# EAGLE design addon (EAGLE 6.6.0)
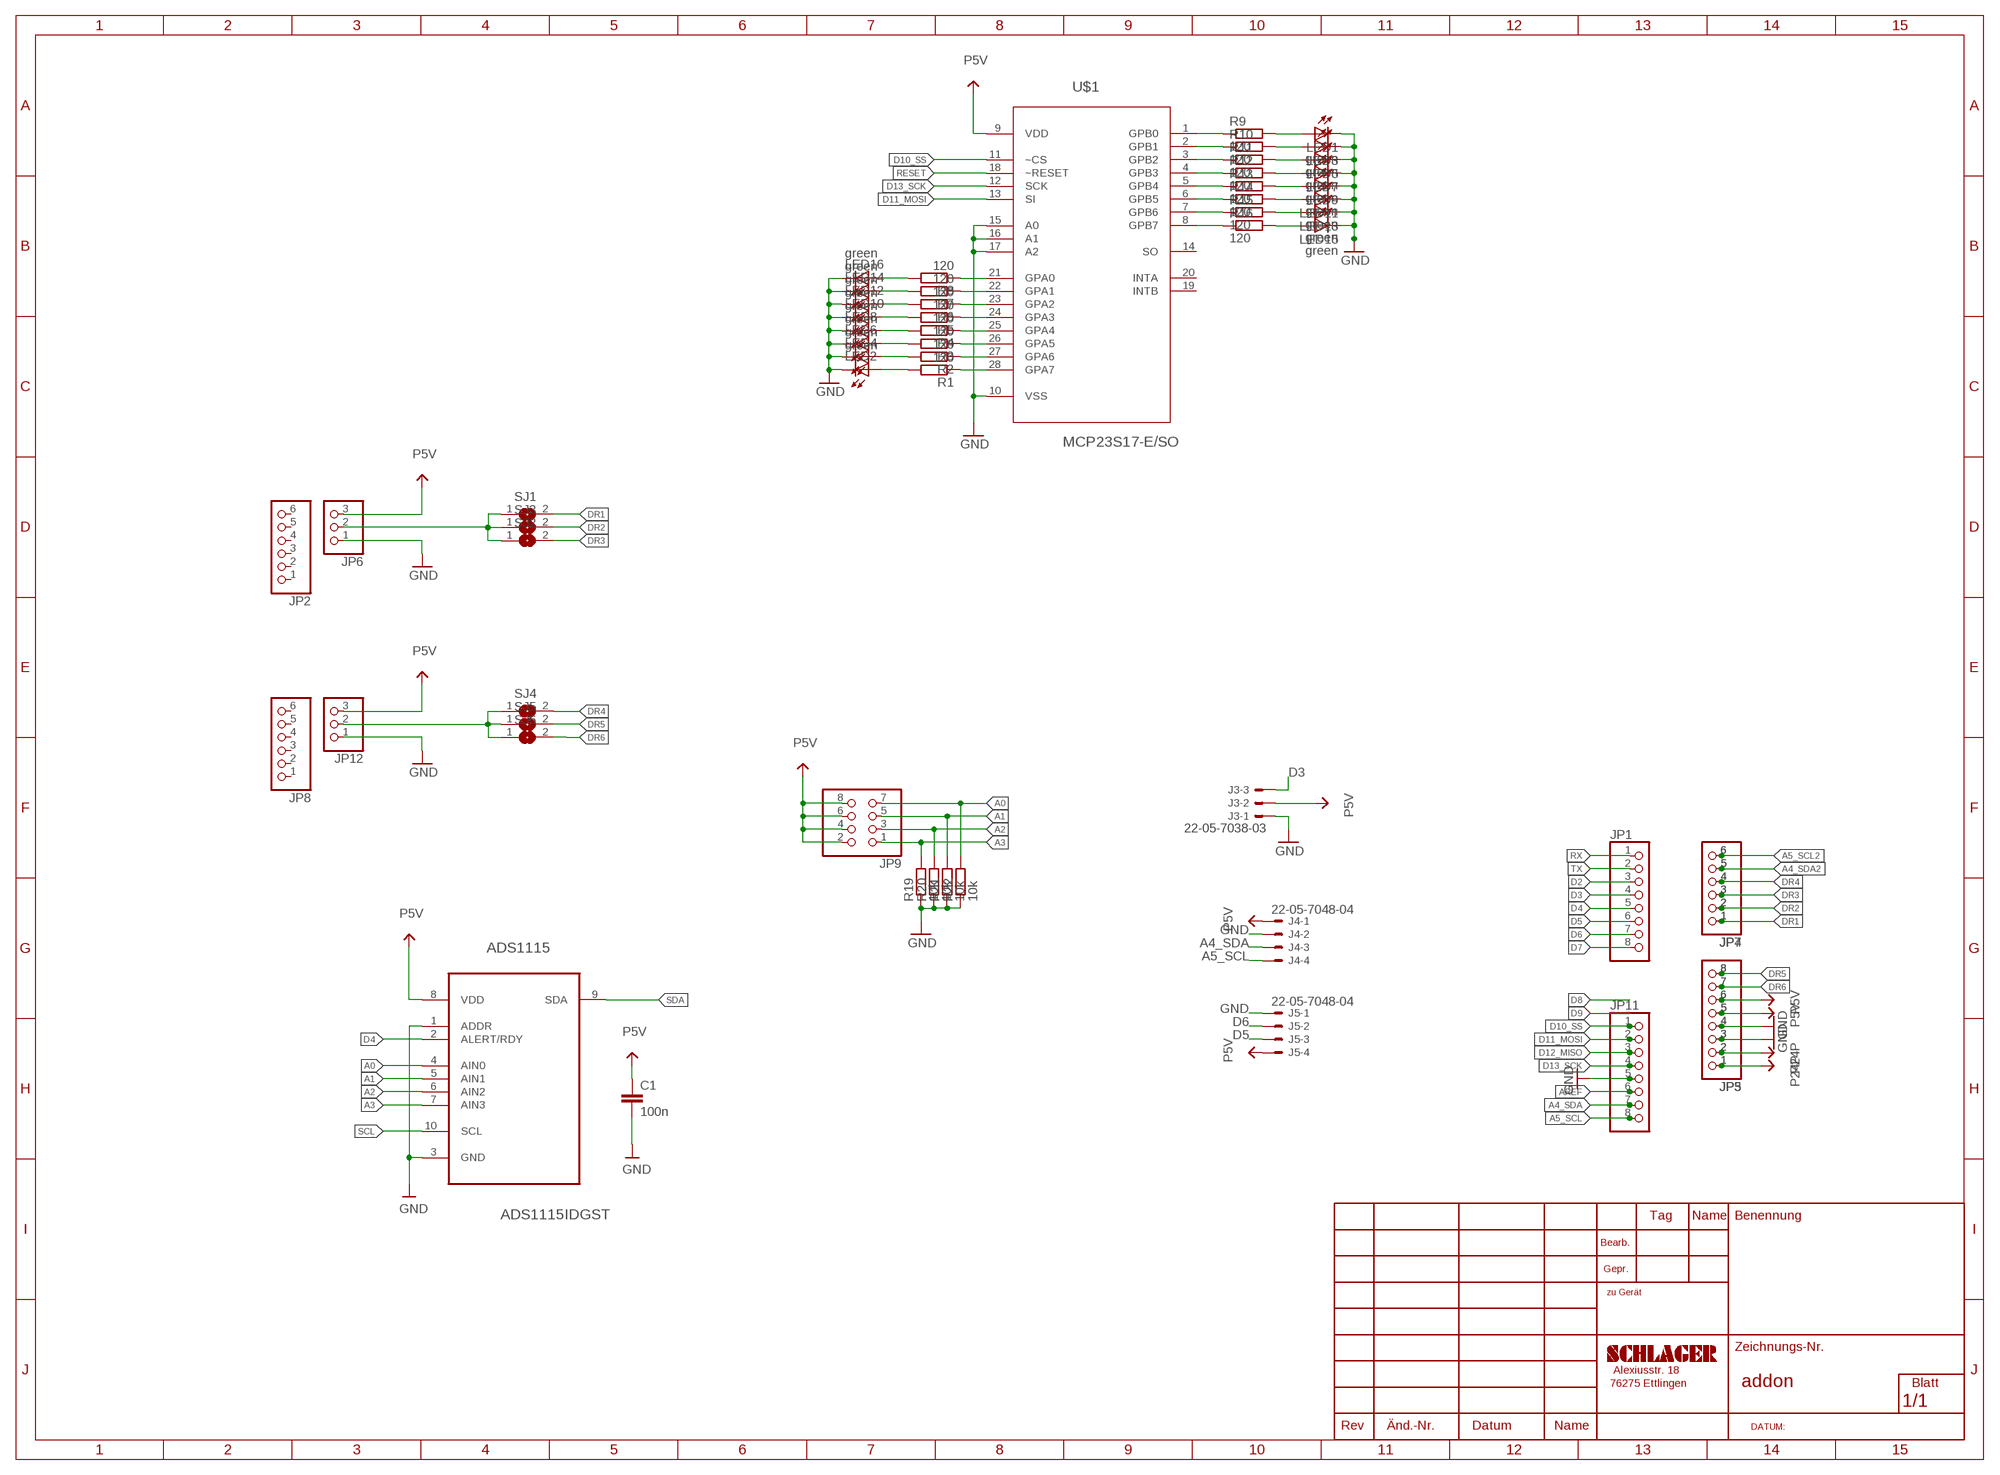
[diagram p0: schematic, sheet 1]

## Parts
ADS1115  ADS1115IDGST  [SOP50P490X110-10N]
C1  100n  C-EUC0805  [C0805]
J3  22-05-7038-03  [7395-03]
J4  22-05-7048-04  [7395-04]
J5  22-05-7048-04  [7395-04]
JP1  PINHD-1X8  [1X08]
JP2  PINHD-1X6  [1X06]
JP3  PINHD-1X8  [1X08]
JP4  PINHD-1X6  [1X06]
JP5  PINHD-1X8  [1X08]
JP6  PINHD-1X3  [1X03]
JP7  PINHD-1X6  [1X06]
JP8  PINHD-1X6  [1X06]
JP9  PINHD-2X4/90  [2X04/90]
JP11  PINHD-1X8  [1X08]
JP12  PINHD-1X3  [1X03]
LED1  green  LEDCHIPLED_0805  [CHIPLED_0805]
LED2  green  LEDCHIPLED_0805  [CHIPLED_0805]
LED3  green  LEDCHIPLED_0805  [CHIPLED_0805]
LED4  green  LEDCHIPLED_0805  [CHIPLED_0805]
LED5  green  LEDCHIPLED_0805  [CHIPLED_0805]
LED6  green  LEDCHIPLED_0805  [CHIPLED_0805]
LED7  green  LEDCHIPLED_0805  [CHIPLED_0805]
LED8  green  LEDCHIPLED_0805  [CHIPLED_0805]
LED9  green  LEDCHIPLED_0805  [CHIPLED_0805]
LED10  green  LEDCHIPLED_0805  [CHIPLED_0805]
LED11  green  LEDCHIPLED_0805  [CHIPLED_0805]
LED12  green  LEDCHIPLED_0805  [CHIPLED_0805]
LED13  green  LEDCHIPLED_0805  [CHIPLED_0805]
LED14  green  LEDCHIPLED_0805  [CHIPLED_0805]
LED15  green  LEDCHIPLED_0805  [CHIPLED_0805]
LED16  green  LEDCHIPLED_0805  [CHIPLED_0805]
R1  120  R-EU_R0805  [R0805]
R2  120  R-EU_R0805  [R0805]
R3  120  R-EU_R0805  [R0805]
R4  120  R-EU_R0805  [R0805]
R5  120  R-EU_R0805  [R0805]
R6  120  R-EU_R0805  [R0805]
R7  120  R-EU_R0805  [R0805]
R8  120  R-EU_R0805  [R0805]
R9  120  R-EU_R0805  [R0805]
R10  120  R-EU_R0805  [R0805]
R11  120  R-EU_R0805  [R0805]
R12  120  R-EU_R0805  [R0805]
R13  120  R-EU_R0805  [R0805]
R14  120  R-EU_R0805  [R0805]
R15  120  R-EU_R0805  [R0805]
R16  120  R-EU_R0805  [R0805]
R19  10k  R-EU_R0805  [R0805]
R20  10k  R-EU_R0805  [R0805]
R21  10k  R-EU_R0805  [R0805]
R22  10k  R-EU_R0805  [R0805]
SJ1  SJ  [SJ]
SJ2  SJ  [SJ]
SJ3  SJ  [SJ]
SJ4  SJ  [SJ]
SJ5  SJ  [SJ]
SJ6  SJ  [SJ]
U$1  MCP23S17-E/SO  [SOIC127P030X265-28N]

## Nets
A0: ADS1115.4(AIN0) JP9.7 R22.2
A1: ADS1115.5(AIN1) JP9.5 R21.2
A2: ADS1115.6(AIN2) JP9.3 R20.2
A3: ADS1115.7(AIN3) JP9.1 R19.2
A4_SDA: J4.3 JP11.7
A4_SDA2: JP4.5 JP7.5
A5_SCL: J4.4 JP11.8
A5_SCL2: JP4.6 JP7.6
AREF: JP11.6
D2: JP1.3
D3: J3.3 JP1.4
D4: ADS1115.2(ALERT/RDY) JP1.5
D5: J5.3 JP1.6
D6: J5.2 JP1.7
D7: JP1.8
D10_SS: JP11.1 U$1.11(~CS)
D11_MOSI: JP11.2 U$1.13(SI)
D12_MISO: JP11.3
D13_SCK: JP11.4 U$1.12(SCK)
DR1: JP4.1 JP7.1 SJ1.2
DR2: JP4.2 JP7.2 SJ3.2
DR3: JP4.3 JP7.3 SJ2.2
DR4: JP4.4 JP7.4 SJ4.2
DR5: JP3.8 JP5.8 SJ5.2
DR6: JP3.7 JP5.7 SJ6.2
GND: ADS1115.1(ADDR) ADS1115.3(GND) C1.2 J3.1 J4.2 J5.1 JP3.3 JP3.4 JP5.3 JP5.4 JP6.1 JP11.5 JP12.1 LED1.C LED2.C LED3.C LED4.C LED5.C LED6.C LED7.C LED8.C LED9.C LED10.C LED11.C LED12.C LED13.C LED14.C LED15.C LED16.C R19.1 R20.1 R21.1 R22.1 U$1.10(VSS) U$1.15(A0) U$1.16(A1) U$1.17(A2)
N$1: LED1.A R9.2
N$2: LED3.A R10.2
N$3: LED5.A R11.2
N$4: LED7.A R12.2
N$5: LED9.A R13.2
N$6: LED11.A R14.2
N$7: LED13.A R15.2
N$8: LED15.A R16.2
N$9: R9.1 U$1.1(GPB0)
N$10: R10.1 U$1.2(GPB1)
N$11: R11.1 U$1.3(GPB2)
N$12: R12.1 U$1.4(GPB3)
N$13: R13.1 U$1.5(GPB4)
N$14: R14.1 U$1.6(GPB5)
N$15: R15.1 U$1.7(GPB6)
N$16: R16.1 U$1.8(GPB7)
N$17: LED2.A R1.2
N$18: LED4.A R2.2
N$19: LED6.A R3.2
N$20: LED8.A R4.2
N$21: LED10.A R5.2
N$22: LED12.A R6.2
N$23: LED14.A R7.2
N$24: LED16.A R8.2
N$25: R1.1 U$1.28(GPA7)
N$26: R2.1 U$1.27(GPA6)
N$27: R3.1 U$1.26(GPA5)
N$28: R4.1 U$1.25(GPA4)
N$29: R5.1 U$1.24(GPA3)
N$30: R6.1 U$1.23(GPA2)
N$31: R7.1 U$1.22(GPA1)
N$32: R8.1 U$1.21(GPA0)
N$33: JP6.2 SJ1.1 SJ2.1 SJ3.1
N$34: JP12.2 SJ4.1 SJ5.1 SJ6.1
P5V: ADS1115.8(VDD) C1.1 J3.2 J4.1 J5.4 JP3.5 JP3.6 JP5.5 JP5.6 JP6.3 JP9.2 JP9.4 JP9.6 JP9.8 JP12.3 U$1.9(VDD)
P24P: JP3.1 JP3.2 JP5.1 JP5.2
RESET: U$1.18(~RESET)
RX: JP1.1
SCL: ADS1115.10(SCL)
SDA: ADS1115.9(SDA)
TX: JP1.2
Unconnected: JP2.1 JP2.2 JP2.3 JP2.4 JP2.5 JP2.6 JP8.1 JP8.2 JP8.3 JP8.4 JP8.5 JP8.6 U$1.14(SO) U$1.19(INTB) U$1.20(INTA)

## Library data of the parts
ADS1115 = schlager_ics:ADS1115IDGST: Analog-to-Digital Converter with Internal Reference; MPN: ADS1115IDGST; OC_FARNELL: 1762981; OC_NEWARK: 25R1241; PACKAGE: MSOP-10; SUPPLIER: Texas Instruments
C1 = schlager_passiv:C-EU: CAPACITOR, European symbol
J3 = con-molex:22-?-03: CONNECTOR wire to board 2.54 mm (.1 inch) pitch header; OC_FARNELL: unknown; OC_NEWARK: unknown
J4 J5 = con-molex:22-?-04: CONNECTOR wire to board 2.54 mm (.1 inch) pitch header; OC_FARNELL: unknown; OC_NEWARK: unknown
JP1 JP3 JP5 JP11 = pinhead:PINHD-1X8: PIN HEADER
JP2 JP4 JP7 JP8 = pinhead:PINHD-1X6: PIN HEADER
JP6 JP12 = pinhead:PINHD-1X3: PIN HEADER
JP9 = pinhead:PINHD-2X4: PIN HEADER
LED1-LED16 = led:LED: LED OSRAM: - CHIPLED LG R971, LG N971, LY N971, LG Q971, LY Q971, LO R971, LY R971 LH N974, LH R974 LS Q976, LO Q976, LY Q976 LO Q996 - Hyper CHIPLED LW Q18S LB Q993, LB Q99A, LB R99A - SideLED LS A670, LO A670, LY A670, LG A670, LP A670 LB A673, LV A673, LT A673, LW A673 LH A674 LY A675 LS A676, LA A676, LO A676, LY A676, LW A676 LS A679, LY A679, LG A679 - Hyper Micro SIDELED® LS Y876, LA Y876, LO Y876, LY Y876 LT Y87S - SmartLED LW L88C, LW L88S LB L89C, LB L89S, LG L890 LS L89K, LO L89K, LY L89K LS L896, LA L896, LO L896, LY L896 - TOPLED LS T670, LO T670, LY T670, LG T670, LP T670 LSG T670, LSP T670, LSY T670, LOP T670, LYG T670 LG T671, LOG T671, LSG T671 LB T673, LV T673, LT T673, LW T673 LH T674 LS T676, LA T676, LO T676, LY T676, LB T676, LH T676, LSB T676, LW T676 LB T67C, LV T67C, LT T67C, LS T67K, LO T67K, LY T67K, LW E67C LS E67B, LA E67B, LO E67B, LY E67B, LB E67C, LV E67C, LT E67C LW T67C LS T679, LY T679, LG T679 LS T770, LO T770, LY T770, LG T770, LP T770 LB T773, LV T773, LT T773, LW T773 LH T774 LS E675, LA E675, LY E675, LS T675 LS T776, LA T776, LO T776, LY T776, LB T776 LHGB T686 LT T68C, LB T68C - Hyper Mini TOPLED® LB M676 - Mini TOPLED Santana® LG M470 LS M47K, LO M47K, LY M47K Source: http://www.osram.convergy.de LUXEON: - LUMILED® LXK2-PW12-R00, LXK2-PW12-S00, LXK2-PW14-U00, LXK2-PW14-V00 LXK2-PM12-R00, LXK2-PM12-S00, LXK2-PM14-U00 LXK2-PE12-Q00, LXK2-PE12-R00, LXK2-PE12-S00, LXK2-PE14-T00, LXK2-PE14-U00 LXK2-PB12-K00, LXK2-PB12-L00, LXK2-PB12-M00, LXK2-PB14-N00, LXK2-PB14-P00, LXK2-PB14-Q00 LXK2-PR12-L00, LXK2-PR12-M00, LXK2-PR14-Q00, LXK2-PR14-R00 LXK2-PD12-Q00, LXK2-PD12-R00, LXK2-PD12-S00 LXK2-PH12-R00, LXK2-PH12-S00 LXK2-PL12-P00, LXK2-PL12-Q00, LXK2-PL12-R00 Source: www.luxeon.com KINGBRIGHT: KA-3528ASYC Source: www.kingbright.com
R1-R16 R19-R22 = rcl:R-EU_: RESISTOR, European symbol
SJ1-SJ6 = jumper:SJ: SMD solder JUMPER
U$1 = schlager_ics:MCP23S17-E/SO: 16-Bit I/O Expander; DESCRIPTION: IC I/O EXPANDER; MPN: MCP23S17-E/SO; OC_FARNELL: 1332093; OC_NEWARK: 31K2950; PACKAGE: SOIC-28; SUPPLIER: Microchip

## Net classes
4 USBpair: width 0.254 mm, drill 0.406 mm, clearance 0.508 mm

## Board
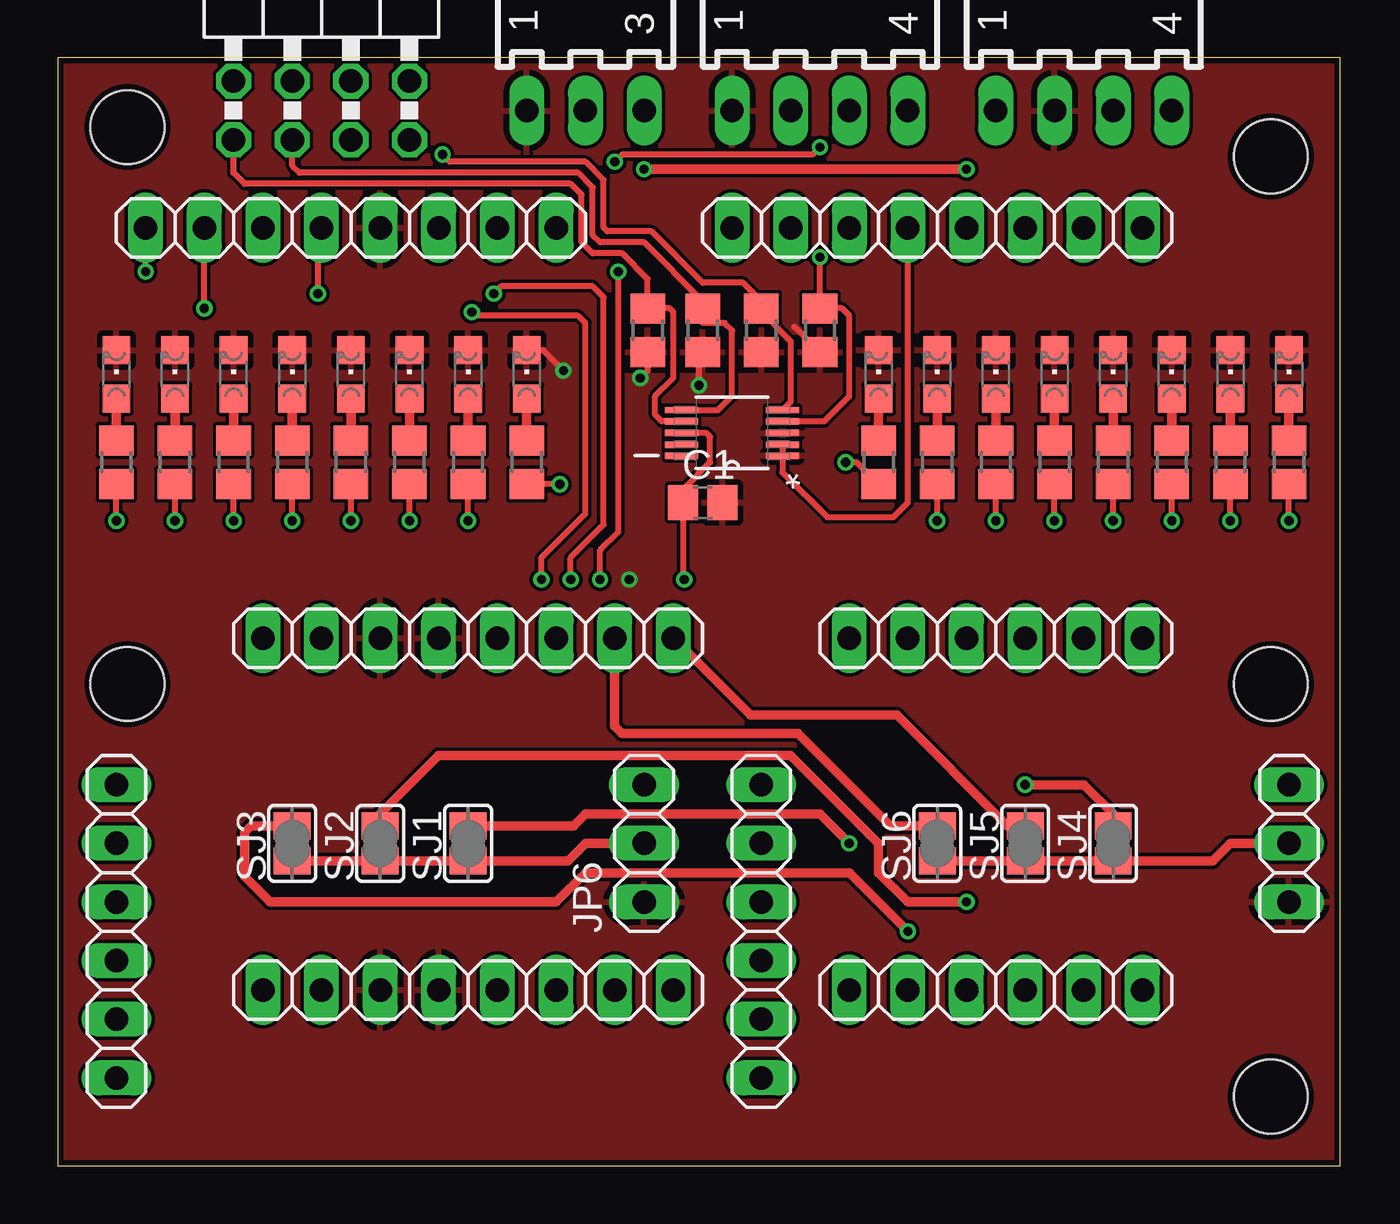
[diagram p1: board, top side]
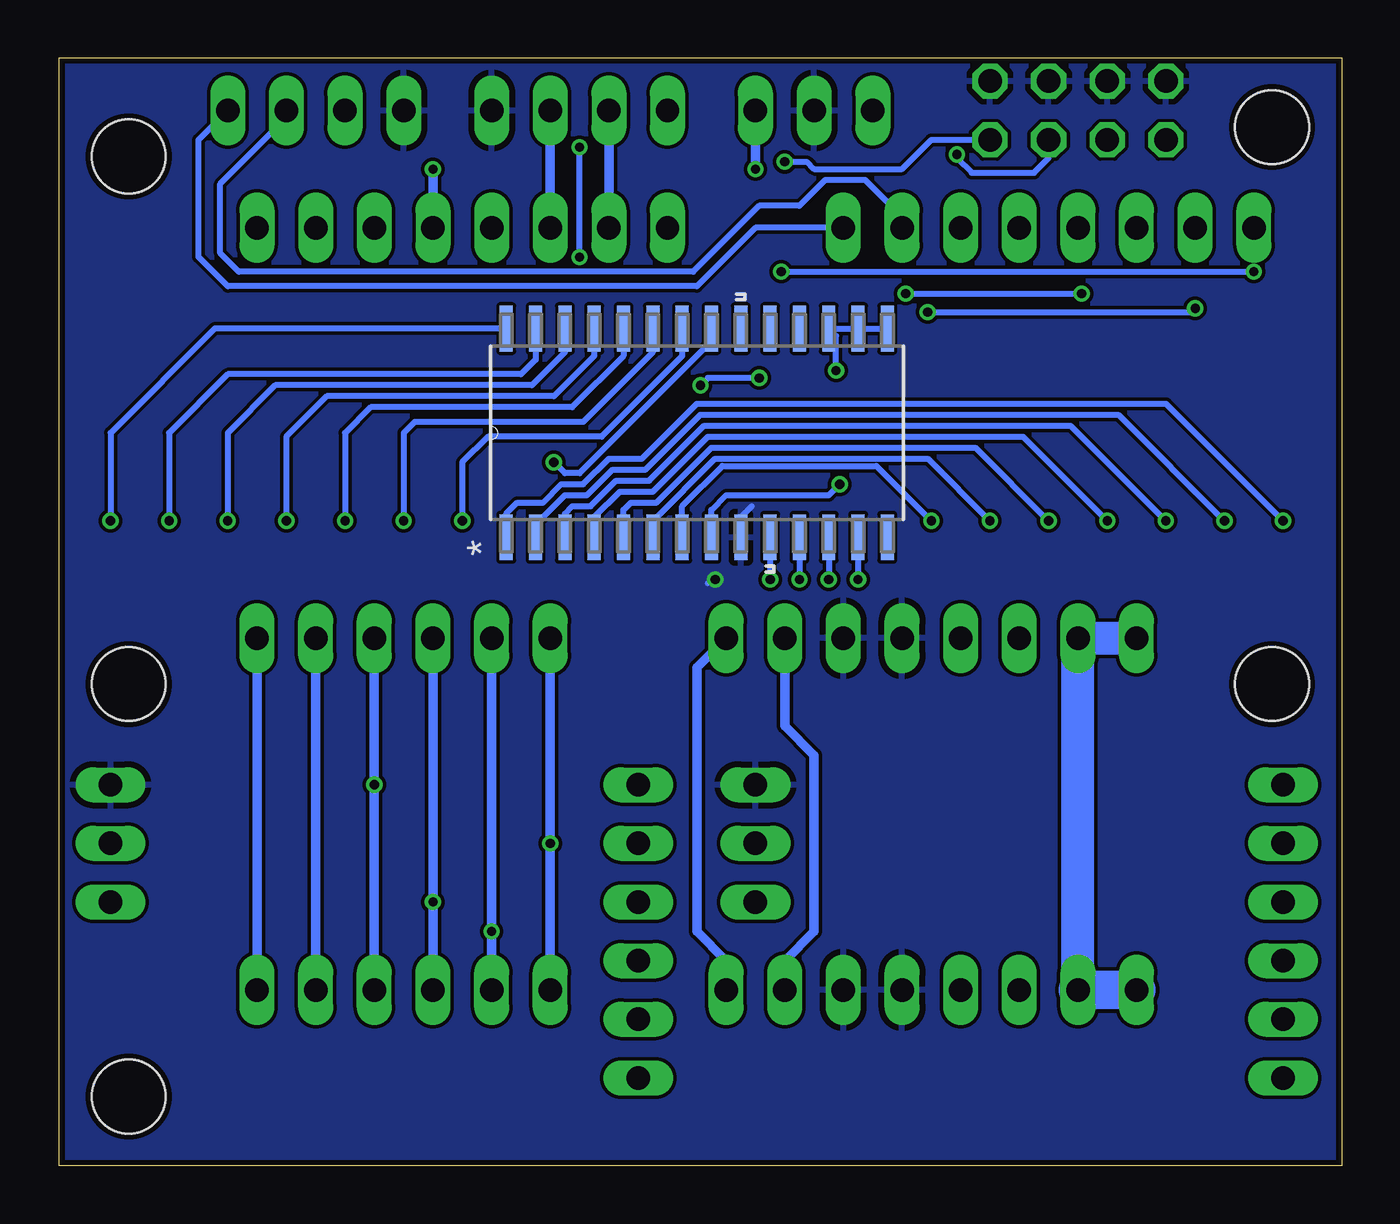
[diagram p2: board, bottom side, seen from below]

Size 55.55 x 48 mm. Coordinates in mm from the lower left corner, seen from the top.
Outline: 0,0 55.55,0 55.55,48 0,48 0,0
Copper layers (1*16): Top 0.035mm / dielectric 1.5mm / Bottom 0.035mm
Design rules "ITEADstudio_DRC": minimum track width 6mil, minimum drill 12mil, track to track 6mil, track to pad 6mil, pad to pad 6mil, via to via 6mil, smd to smd 0mil, copper to edge 10mil, drill to drill 10mil, minimum pad ring 10mil, minimum via ring 6mil, stop-mask expansion 2mil, vias tented up to drill 100mil, thermal gap 10mil
Holes 3.2 mm at 52.55,43.73 52.55,3 3.02,45 3.02,20.87 52.55,20.87

### Footprints (pad centres in the part's own frame; a part is rotated, then mirrored left to right if it is on the bottom)
SOP50P490X110-10N = smd 1.422 x 0.279: 1 -2.184,0.991; 2 -2.184,0.508; 3 -2.184,0; 4 -2.184,-0.508; 5 -2.184,-0.991; 6 2.184,-0.991; 7 2.184,-0.508; 8 2.184,0; 9 2.184,0.508; 10 2.184,0.991
C0805 = smd 1.3 x 1.5: 1 -0.85,0; 2 0.85,0
7395-03 = drill 1.016 long: 1 2.54,0; 2 0,0; 3 -2.54,0
7395-04 = drill 1.016 long: 1 3.81,0; 2 1.27,0; 3 -1.27,0; 4 -3.81,0
1X08 = drill 1.016 long: 1 -8.89,0; 2 -6.35,0; 3 -3.81,0; 4 -1.27,0; 5 1.27,0; 6 3.81,0; 7 6.35,0; 8 8.89,0
1X06 = drill 1.016 long: 1 -6.35,0; 2 -3.81,0; 3 -1.27,0; 4 1.27,0; 5 3.81,0; 6 6.35,0
1X03 = drill 1.016 long: 1 -2.54,0; 2 0,0; 3 2.54,0
2X04/90 = drill 1.016 octagon: 1 -3.81,-6.35; 2 -3.81,-3.81; 3 -1.27,-6.35; 4 -1.27,-3.81; 5 1.27,-6.35; 6 1.27,-3.81; 7 3.81,-6.35; 8 3.81,-3.81
CHIPLED_0805 = smd 1.2 x 1.2: A 0,-1.05; C 0,1.05
R0805 = smd 1.3 x 1.5: 1 -0.95,0; 2 0.95,0
SJ = smd 1.168 x 1.6: 1 -0.762,0; 2 0.762,0
SOIC127P030X265-28N = smd 1.981 x 0.559: 1 -4.521,8.255; 2 -4.521,6.985; 3 -4.521,5.715; 4 -4.521,4.445; 5 -4.521,3.175; 6 -4.521,1.905; 7 -4.521,0.635; 8 -4.521,-0.635; 9 -4.521,-1.905; 10 -4.521,-3.175; 11 -4.521,-4.445; 12 -4.521,-5.715; 13 -4.521,-6.985; 14 -4.521,-8.255; 15 4.521,-8.255; 16 4.521,-6.985; 17 4.521,-5.715; 18 4.521,-4.445; 19 4.521,-3.175; 20 4.521,-1.905; 21 4.521,-0.635; 22 4.521,0.635; 23 4.521,1.905; 24 4.521,3.175; 25 4.521,4.445; 26 4.521,5.715; 27 4.521,6.985; 28 4.521,8.255

### Placement (x,y rotation side)
ADS1115  29.21,31.75 180 top
C1  27.94,28.73 0 top
J3  22.86,45.72 180 top
J4  44.45,45.72 180 top
J5  33.02,45.72 180 top
JP1  38.1,40.64 180 top
JP2  2.54,10.16 90 top
JP3  17.78,22.86 0 top
JP4  40.64,7.62 0 top
JP5  17.78,7.62 0 top
JP6  25.4,13.97 90 top
JP7  40.64,22.86 0 top
JP8  30.48,10.16 90 top
JP9  11.43,50.8 0 top
JP11  12.7,40.64 0 top
JP12  53.34,13.97 90 top
LED1  2.54,34.29 0 top
LED2  53.34,34.29 0 top
LED3  5.08,34.29 0 top
LED4  50.8,34.29 0 top
LED5  7.62,34.29 0 top
LED6  48.26,34.29 0 top
LED7  10.16,34.29 0 top
LED8  45.72,34.29 0 top
LED9  12.7,34.29 0 top
LED10  43.18,34.29 0 top
LED11  15.24,34.29 0 top
LED12  40.64,34.29 0 top
LED13  17.78,34.29 0 top
LED14  38.1,34.29 0 top
LED15  20.32,34.29 0 top
LED16  35.56,34.29 0 top
R1  53.34,30.48 90 top
R2  50.8,30.48 90 top
R3  48.26,30.48 90 top
R4  45.72,30.48 90 top
R5  43.18,30.48 90 top
R6  40.64,30.48 90 top
R7  38.1,30.48 90 top
R8  35.56,30.48 90 top
R9  2.54,30.48 90 top
R10  5.08,30.48 90 top
R11  7.62,30.48 90 top
R12  10.16,30.48 90 top
R13  12.7,30.48 90 top
R14  15.24,30.48 90 top
R15  17.78,30.48 90 top
R16  20.32,30.48 90 top
R19  25.56,36.2 90 top
R20  27.94,36.2 90 top
R21  30.48,36.2 90 top
R22  33.02,36.2 90 top
SJ1  17.78,13.97 90 top
SJ2  13.97,13.97 90 top
SJ3  10.16,13.97 90 top
SJ4  45.72,13.97 90 top
SJ5  41.91,13.97 90 top
SJ6  38.1,13.97 90 top
U$1  27.94,31.75 90 bottom

### Tracks (layer width: path | path; a pad name or v marks a point on that pad's centre or on a via)
A0  (via drill 0.4)
  Top 0.254: ADS1115.4 33.21,32.26 34.29,33.34 34.29,36.83 33.97,37.15 R22.2 v33.02,39.37 | v33.02,44.13 32.7,43.81 24.45,43.81 v24.13,43.5
  Bottom 0.254: v24.13,43.5 23.18,43.5 22.86,43.18 19.05,43.18 17.78,44.45 JP9.7 | v33.02,39.37 v33.02,44.13
A1  (via drill 0.4)
  Top 0.254: ADS1115.5 31.75,33.1 31.75,35.72 31.12,36.35 R21.2 30.48,37.47 29.69,38.26 27.94,38.26 25.72,40.48 23.81,40.48 23.65,40.64 23.65,42.7 22.86,43.5 16.99,43.5 v16.67,43.81
  Bottom 0.254: v16.67,43.81 16.67,43.66 16.03,43.02 13.34,43.02 12.7,43.66 JP9.5
A2
  Top 0.254: ADS1115.6 28.61,32.74 29.21,33.34 29.21,36.2 28.89,36.51 27.94,36.51 R20.2 27.94,37.47 25.4,40.01 23.5,40.01 23.18,40.32 23.18,42.39 22.54,43.02 10.48,43.02 10.16,43.34 JP9.3
A3
  Top 0.254: ADS1115.7 26.16,32.26 25.88,32.54 25.88,33.34 26.67,34.13 26.67,36.99 26.51,37.15 R19.2 25.56,38.42 24.45,39.53 23.18,39.53 22.7,40.01 22.7,42.07 22.23,42.55 8.1,42.55 7.62,43.02 JP9.1
A4_SDA
  Bottom 0.254: JP11.7 19.05,41.12 20.64,42.7 22.38,42.7 23.5,41.59 25.24,41.59 28.1,38.73 47.78,38.73 48.58,39.53 48.58,42.55 46.2,44.93 46.2,45.24 J4.3
A4_SDA2
  Bottom 0.406: JP4.5 JP7.5
A5_SCL
  Bottom 0.254: JP11.8 25.4,40.64 27.94,38.1 48.26,38.1 49.53,39.37 49.53,44.45 J4.4
A5_SCL2
  Bottom 0.406: JP4.6 JP7.6
D3  (via drill 0.4)
  Top 0.406: v25.4,43.18 v39.37,43.18
  Bottom 0.406: J3.3 v25.4,43.18 | v39.37,43.18 JP1.4
D4
  Top 0.254: ADS1115.2 31.39,30.04 33.34,28.1 36.2,28.1 36.83,28.73 JP1.5
D5
  Bottom 0.406: JP1.6 J5.3
D6
  Bottom 0.406: JP1.7 J5.2
D10_SS  (via drill 0.4)
  Top 0.254: v23.5,25.4 23.5,26.67 24.29,27.46 v24.29,38.73 | v3.81,38.73 JP11.1
  Bottom 0.254: U$1.11 v23.5,25.4 | v24.29,38.73 v3.81,38.73
D11_MOSI  (via drill 0.4)
  Top 0.254: v20.95,25.4 20.95,26.35 22.86,28.26 22.86,36.51 22.54,36.83 18.1,36.83 v17.94,36.99 | v6.35,37.15 JP11.2
  Bottom 0.254: U$1.13 v20.95,25.4 | v17.94,36.99 6.51,36.99 v6.35,37.15
D13_SCK  (via drill 0.4)
  Top 0.254: v22.23,25.4 22.23,26.35 23.65,27.78 23.65,37.62 23.18,38.1 19.21,38.1 v18.89,37.78 | v11.27,37.78 11.27,40.48 JP11.4
  Bottom 0.254: U$1.12 v22.23,25.4 | v18.89,37.78 v11.27,37.78
DR1  (via drill 0.4)
  Top 0.406: SJ1.2 22.35,14.73 22.86,15.24 33.02,15.24 v34.29,13.97
  Bottom 0.406: JP4.1 v34.29,13.97 JP7.1
DR2  (via drill 0.4)
  Top 0.406: SJ3.2 8.38,14.73 8.1,14.45 8.1,12.54 9.21,11.43 21.59,11.43 22.86,12.7 34.29,12.7 v36.83,10.16
  Bottom 0.406: JP7.2 v36.83,10.16 JP4.2
DR3  (via drill 0.4)
  Top 0.406: SJ2.2 13.97,15.24 16.51,17.78 31.75,17.78 35.56,13.97 35.56,12.7 36.83,11.43 v39.37,11.43
  Bottom 0.406: JP4.3 v39.37,11.43 JP7.3
DR4  (via drill 0.4)
  Top 0.406: SJ4.2 45.72,15.24 44.45,16.51 v41.91,16.51
  Bottom 0.406: JP4.4 v41.91,16.51 JP7.4
DR5
  Top 0.406: SJ5.2 41.15,14.73 36.35,19.53 30,19.53 JP3.8
  Bottom 0.406: JP5.8 26.67,8.89 27.94,10.16 27.94,21.59 JP3.8
DR6
  Top 0.406: SJ6.2 36.07,14.73 32.07,18.73 24.45,18.73 24.13,19.05 JP3.7
  Bottom 0.406: JP5.7 24.13,8.89 22.86,10.16 22.86,17.78 24.13,19.05 JP3.7
GND  (via drill 0.4)
  Top 0.254: v24.77,25.4 24.77,25.24 | LED15.C 21.02,35.34 v21.91,34.45 | R22.1 31.91,36.35 | R19.1 25.56,34.45 v25.24,34.13 | v27.78,33.81 27.78,35.09 R20.1
  Bottom 0.254: U$1.10 v24.77,25.4 | U$1.15 U$1.16 U$1.17 21.91,35.95 v21.91,34.45 | v25.24,34.13 27.46,34.13 v27.78,33.81
  pour Top (rank 5): -5.56,68.58 107.95,68.58 107.95,-30.48 -2.06,-30.32 -5.87,24.29 -5.56,25.4
N$1
  Top 0.406: LED1.A R9.2
N$2
  Top 0.406: LED3.A R10.2
N$3
  Top 0.406: R11.2 LED5.A
N$4
  Top 0.406: LED7.A R12.2
N$5
  Top 0.406: R13.2 LED9.A
N$6
  Top 0.406: LED11.A R14.2
N$7
  Top 0.406: R15.2 LED13.A
N$8
  Top 0.406: LED15.A R16.2
N$9  (via drill 0.4)
  Top 0.254: v2.54,27.94 R9.1
  Bottom 0.254: U$1.1 36.2,28.26 35.72,28.73 34.61,28.73 33.81,29.53 32.86,29.53 31.75,30.64 30.32,30.64 27.94,33.02 7.62,33.02 v2.54,27.94
N$10  (via drill 0.4)
  Top 0.254: v5.08,27.94 R10.1
  Bottom 0.254: U$1.2 34.92,27.78 33.66,29.05 32.7,29.05 31.59,30.16 30.16,30.16 27.78,32.54 9.68,32.54 v5.08,27.94
N$11  (via drill 0.4)
  Top 0.254: v7.62,27.94 R11.1
  Bottom 0.254: U$1.3 33.66,28.26 33.34,28.57 32.54,28.57 31.43,29.69 30,29.69 27.62,32.07 11.75,32.07 v7.62,27.94
N$12  (via drill 0.4)
  Top 0.254: v10.16,27.94 R12.1
  Bottom 0.254: U$1.4 32.38,28.1 31.27,29.21 29.84,29.21 27.46,31.59 13.81,31.59 v10.16,27.94
N$13  (via drill 0.4)
  Top 0.254: v12.7,27.94 R13.1
  Bottom 0.254: U$1.5 31.11,28.42 30.8,28.73 29.69,28.73 27.3,31.11 15.88,31.11 v12.7,27.94
N$14  (via drill 0.4)
  Top 0.254: v15.24,27.94 R14.1
  Bottom 0.254: U$1.6 29.84,27.94 27.15,30.64 17.94,30.64 v15.24,27.94
N$15  (via drill 0.4)
  Top 0.254: v17.78,27.94 R15.1
  Bottom 0.254: U$1.7 28.57,28.57 26.83,30.32 20.16,30.32 v17.78,27.94
N$16  (via drill 0.4)
  Top 0.254: v21.75,29.53 R16.1
  Bottom 0.254: U$1.8 27.3,28.42 26.67,29.05 22.23,29.05 v21.75,29.53
N$17
  Top 0.406: LED2.A R1.2
N$18
  Top 0.406: R2.2 LED4.A
N$19
  Top 0.406: LED6.A R3.2
N$20
  Top 0.406: R4.2 LED8.A
N$21
  Top 0.406: LED10.A R5.2
N$22
  Top 0.406: R6.2 LED12.A
N$23
  Top 0.406: R7.2 LED14.A
N$24
  Top 0.406: R8.2 LED16.A
N$25  (via drill 0.4)
  Top 0.254: v53.34,27.94 R1.1
  Bottom 0.254: U$1.28 48.82,36.27 53.34,31.75 v53.34,27.94
N$26  (via drill 0.4)
  Top 0.254: v50.8,27.94 R2.1
  Bottom 0.254: U$1.27 34.92,34.92 35.56,34.29 48.26,34.29 50.8,31.75 v50.8,27.94
N$27  (via drill 0.4)
  Top 0.254: v48.26,27.94 R3.1
  Bottom 0.254: U$1.26 33.66,35.24 35.08,33.81 46.2,33.81 48.26,31.75 v48.26,27.94
N$28  (via drill 0.4)
  Top 0.254: v45.72,27.94 R4.1
  Bottom 0.254: U$1.25 32.38,35.08 34.13,33.34 43.97,33.34 45.72,31.59 v45.72,27.94
N$29  (via drill 0.4)
  Top 0.254: v43.18,27.94 R5.1
  Bottom 0.254: U$1.24 31.11,35.08 33.34,32.86 42.07,32.86 43.18,31.75 v43.18,27.94
N$30  (via drill 0.4)
  Top 0.254: v40.64,27.94 R6.1
  Bottom 0.254: U$1.23 29.84,35.24 32.86,32.23 40.16,32.23 40.64,31.75 v40.64,27.94
N$31  (via drill 0.4)
  Top 0.254: v38.1,27.94 R7.1
  Bottom 0.254: U$1.22 28.57,35.08 32.07,31.59 36.99,31.59 38.1,30.48 v38.1,27.94
N$32  (via drill 0.4)
  Top 0.254: 35.4,29.69 R8.1 34.61,30.48 v34.13,30.48
  Bottom 0.254: U$1.21 27.3,35.72 33.02,30 33.66,30 v34.13,30.48
N$33
  Top 0.406: SJ3.1 SJ2.1 SJ1.1 22.1,13.21 22.86,13.97 JP6.2
N$34
  Top 0.406: SJ6.1 SJ5.1 SJ4.1 50.04,13.21 50.8,13.97 JP12.2
P5V  (via drill 0.4)
  Top 0.254: 26.99,31.75 ADS1115.8 28.1,31.75 28.26,31.59 28.26,30.48 27.15,29.37 27.15,28.79 C1.1 27.09,25.46 v27.15,25.4
  Bottom 0.254: U$1.9 26.04,28.1 25.56,28.57 | v27.15,25.4 27.3,25.4 27.46,25.24
  pour Bottom: -49.53,71.12 119.38,71.12 119.38,-38.1 -48.26,-39.37
P24P
  Bottom 1.422: JP5.2 JP3.2 JP3.1
  Bottom 1.676: JP5.2 JP5.1